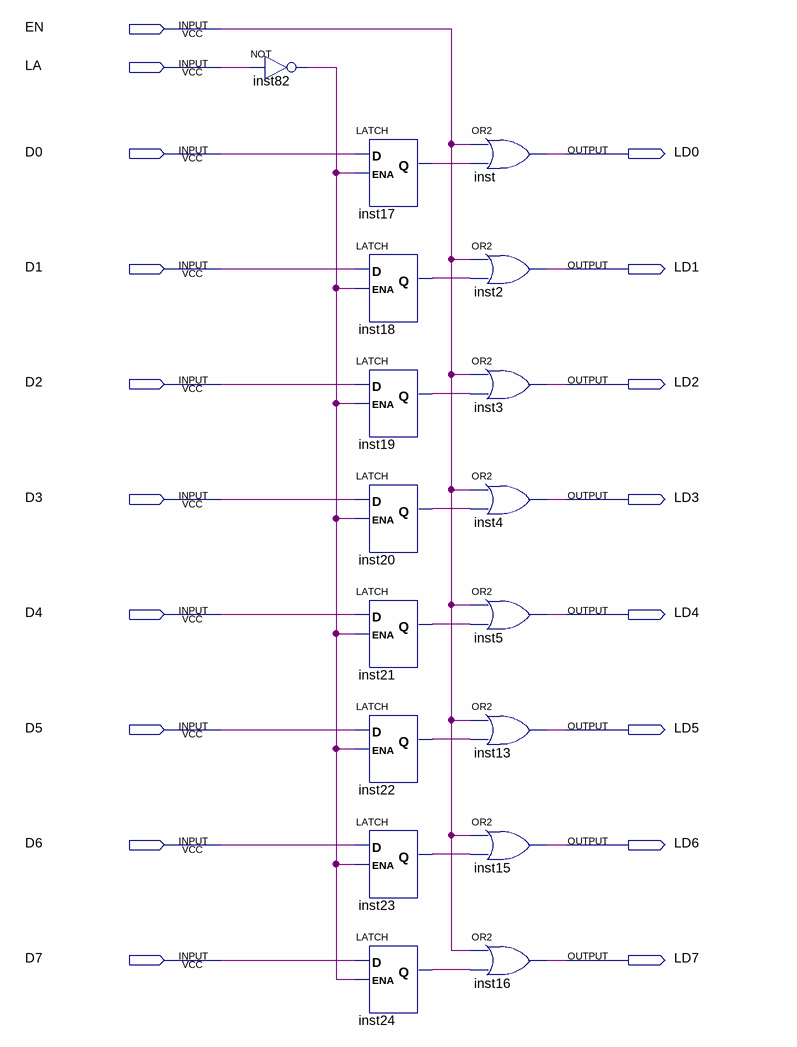
[diagram p0: schematic sheet]
// Quartus schematic 8latchhole0b.bdf as structural Verilog: 17 symbols, 18 pins
module \8latchhole0b  (
  input  EN,
  input  LA,
  input  D0,
  input  D1,
  input  D2,
  input  D3,
  input  D4,
  input  D5,
  input  D6,
  input  D7,
  output LD0,
  output LD1,
  output LD2,
  output LD3,
  output LD4,
  output LD5,
  output LD6,
  output LD7
);

  wire inst17_q, inst18_q, inst19_q, inst20_q, inst21_q, inst22_q, inst23_q, inst24_q, inst82_out;

  not inst82 (inst82_out, LA);
  LATCH inst17 (.D(D0), .ENA(inst82_out), .Q(inst17_q));
  LATCH inst18 (.D(D1), .ENA(inst82_out), .Q(inst18_q));
  LATCH inst19 (.D(D2), .ENA(inst82_out), .Q(inst19_q));
  LATCH inst20 (.D(D3), .ENA(inst82_out), .Q(inst20_q));
  LATCH inst21 (.D(D4), .ENA(inst82_out), .Q(inst21_q));
  LATCH inst22 (.D(D5), .ENA(inst82_out), .Q(inst22_q));
  LATCH inst23 (.D(D6), .ENA(inst82_out), .Q(inst23_q));
  LATCH inst24 (.D(D7), .ENA(inst82_out), .Q(inst24_q));
  or inst (LD0, EN, inst17_q);
  or inst2 (LD1, EN, inst18_q);
  or inst3 (LD2, EN, inst19_q);
  or inst4 (LD3, EN, inst20_q);
  or inst5 (LD4, EN, inst21_q);
  or inst13 (LD5, EN, inst22_q);
  or inst15 (LD6, EN, inst23_q);
  or inst16 (LD7, EN, inst24_q);
endmodule
